# EasyEDA Pro project PCB.eprj, schematic Schematic2_1
Board Name: 电机双驱_终; Create Date: 2024-12-27; Page Name: 逐飞原理图; Project Name: 原创DRV8701E电机双驱; Schematic Name: Schematic2_1; Update Date: 2025-03-12; Company: 嘉立创EDA; Page Size: A4; Version: V1.0
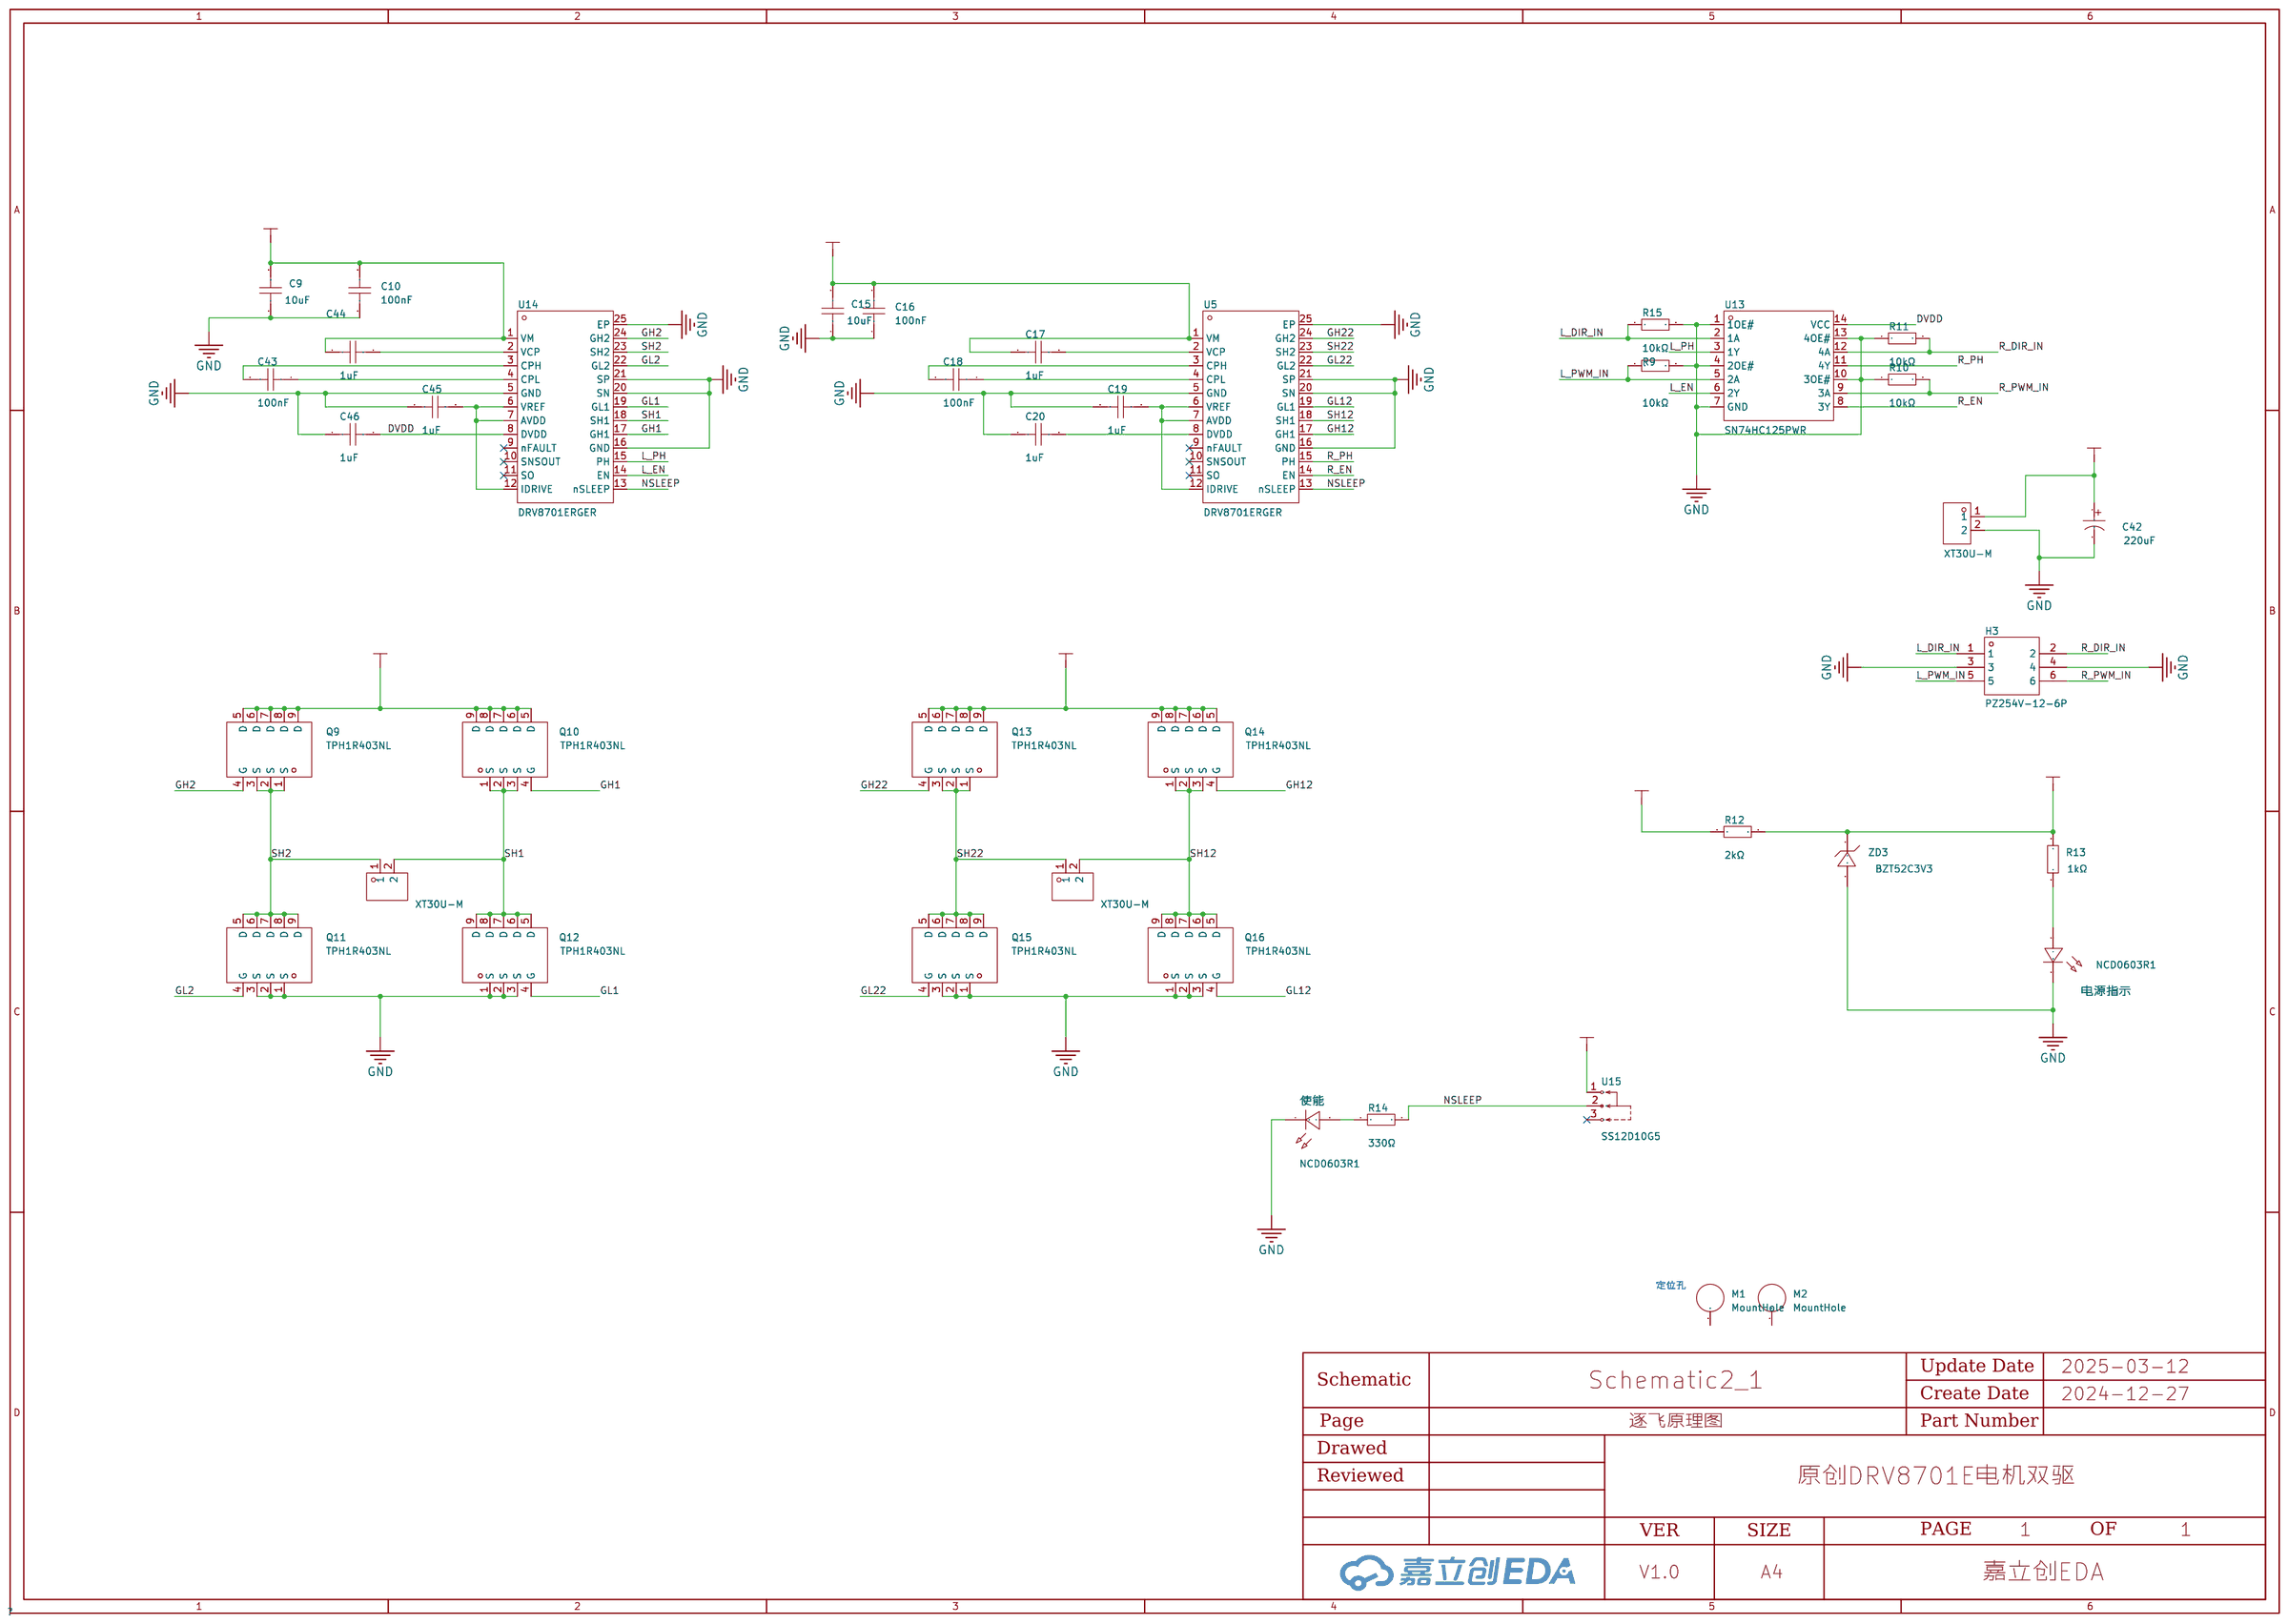
[diagram p2: schematic sheet]

## Parts
C9  10uF  [C0603]
C10  100nF  [C0603]
C15  10uF  [C0603]
C16  100nF  [C0603]
C17  1uF  [C0603]
C18  100nF  [C0603]
C19  1uF  [C0603]
C20  1uF  [C0603]
C42  220uF  [CAP-TH_BD6.3-P2.50-D1.0-FD]
C43  100nF  [C0603]
C44  1uF  [C0603]
C45  1uF  [C0603]
C46  1uF  [C0603]
CN1  XT30U-M  [CONN-TH_XT30U-M]
CN2  XT30U-M  [CONN-TH_XT30U-M]
CN3  XT30U-M  [CONN-TH_XT30U-M]
H3  PZ254V-12-6P  [HDR-TH_6P-P2.54-V-M-R2-C3-S2.54]
M1  MountHole  [M3-MountHole-Plated]
M2  MountHole  [M3-MountHole-Plated]
Q9  TPH1R403NL  [DSOP-8_L5.0-W5.0-P1.27-LS6.0-BL-EP]
Q10  TPH1R403NL  [DSOP-8_L5.0-W5.0-P1.27-LS6.0-BL-EP]
Q11  TPH1R403NL  [DSOP-8_L5.0-W5.0-P1.27-LS6.0-BL-EP]
Q12  TPH1R403NL  [DSOP-8_L5.0-W5.0-P1.27-LS6.0-BL-EP]
Q13  TPH1R403NL  [DSOP-8_L5.0-W5.0-P1.27-LS6.0-BL-EP]
Q14  TPH1R403NL  [DSOP-8_L5.0-W5.0-P1.27-LS6.0-BL-EP]
Q15  TPH1R403NL  [DSOP-8_L5.0-W5.0-P1.27-LS6.0-BL-EP]
Q16  TPH1R403NL  [DSOP-8_L5.0-W5.0-P1.27-LS6.0-BL-EP]
R9  10kΩ  [R0603]
R10  10kΩ  [R0603]
R11  10kΩ  [R0603]
R12  2kΩ  [R0603]
R13  1kΩ  [R0603]
R14  330Ω  [R0603]
R15  10kΩ  [R0603]
U5  DRV8701ERGER  [VQFN-24_L4.0-W4.0-P0.50-BL-EP2.5]
U13  SN74HC125PWR  [TSSOP-14_L5.0-W4.4-P0.65-LS6.5-BL]
U14  DRV8701ERGER  [VQFN-24_L4.0-W4.0-P0.50-BL-EP2.5]
U15  SS12D10G5  [SW-TH_SHOU-HAN_SS12D10G4]
ZD3  BZT52C3V3  [SOD-123_L2.8-W1.8-LS3.7-RD]
使能  NCD0603R1  [LED0603-RD_RED]
电源指示  NCD0603R1  [LED0603-RD_RED]

## Library data of the parts
C9 C15 = CC0603KRX5R6BB106: 容值:10uF;精度:±10%;额定电压:10V;材质(温度系数):X5R;; LCSC Part Name: 10uF ±10% 10V; Supplier Part: C326057; Manufacturer: YAGEO(国巨); Supplier Footprint: 0603; JLCPCB Part Class: Extended Part; Datasheet: https://atta.szlcsc.com/upload/public/pdf/source/20181031/C326057_4190003E428C5A97DF6434D0EAB53BEA.pdf; Supplier: LCSC; Tolerance: ±10%; Voltage Rated: 10V; Temperature Coefficient: X5R
C10 C16 C18 C43 = CC0603KRX7R0BB104: 容值:100nF;精度:±10%;额定电压:100V;材质(温度系数):X7R;; LCSC Part Name: 100nF ±10% 100V; Supplier Part: C113803; Manufacturer: YAGEO(国巨); Supplier Footprint: 0603; JLCPCB Part Class: Extended Part; Datasheet: https://atta.szlcsc.com/upload/public/pdf/source/20181015/C113803_C823A7F2167996AC3CF21DCEABCAAB90.pdf; Supplier: LCSC; Tolerance: ±10%; Voltage Rated: 100V; Temperature Coefficient: X7R
C17 C19 C20 C44-C46 = CC0603KRX5R7BB105: 容值:1uF;精度:±10%;额定电压:16V;材质(温度系数):X5R;; LCSC Part Name: 1uF ±10% 16V; Supplier Part: C106215; Manufacturer: YAGEO(国巨); Supplier Footprint: 0603; JLCPCB Part Class: Extended Part; Datasheet: https://atta.szlcsc.com/upload/public/pdf/source/20180326/C106215_8B940387666B281FC7797B8C1E6DEEC9.pdf; Supplier: LCSC; Tolerance: ±10%; Voltage Rated: 16V; Temperature Coefficient: X5R
C42 = 25YXJ220M6.3X11: 容值:220uF;精度:±20%;额定电压:25V;纹波电流:400mA@100kHz;等效串联电阻:220mΩ@100kHz;; LCSC Part Name: 220uF±20%25V; Supplier Part: C88729; Manufacturer: rubycon(红宝石); Supplier Footprint: 插件,D6.3xL11mm; JLCPCB Part Class: 扩展库; Datasheet: https://atta.szlcsc.com/upload/public/pdf/source/20161125/1480067872683.pdf; Supplier: LCSC; Tolerance: ±20%; Rated Voltage: 25V; φD: 6.3mm; L: 11mm; Lead Spacing: 2.5mm; Ripple Current: 400mA@100kHz; Equivalent Series Resistance(ESR): 220mΩ@100kHz; Lifetime @ Temp: 7000hrs@105℃
CN1-CN3 = XT30U-M: 类别:-;类型1:-;; LCSC Part Name: AMASS(艾迈斯)轻量版锂电池插头公头 XT30U-M; Supplier Part: C99101; Manufacturer: AMASS(艾迈斯); JLCPCB Part Class: 扩展库; Datasheet: https://atta.szlcsc.com/upload/public/pdf/source/20170606/1496716542582.pdf; Supplier: LCSC; Type: 插头; Colour: 黄色; InterfaceType: 公头
H3 = PZ254V-12-6P: 插针结构:2x3P;间距:2.54mm;行距:2.54mm;圆针/方针:方针;安装类型:直插;排数:双排;总PIN位数:6P;额定电流:-;额定电压:-;配合针长度:6mm;塑高:2.5mm;端接针长度:3mm;触头材质:黄铜;触头镀层:-;工作温度范围:-40℃~+105℃;颜色:黑色;; LCSC Part Name: 间距:2.54mm 2x3P 直插 方针; Supplier Part: C492420; Manufacturer: XFCN(兴飞); Supplier Footprint: 插件,P=2.54mm; JLCPCB Part Class: 扩展库; Datasheet: https://atta.szlcsc.com/upload/public/pdf/source/20200309/C492420_BAECB307B001054C09D200388220EAE6.pdf; Supplier: LCSC; Pin Structure: 2x3P; Pitch: 2.54mm; Row Spacing: 2.54mm; Circluar Pins/Square Pins: 方针; Mounting Type: 直插; Number of Rows: 双排; Number of Pins: 6P; Length of Mating Pin: 6mm; Insulation Height: 2.5mm; Length of End Connection Pin: 3mm; Contact Material: 黄铜; Operating Temperature Range: -40℃~+105℃; Color: 黑色
M1 M2 = MountHole: Origin Footprint 2: M3-MountHole; Origin Footprint 3: M3-MountSlot; Origin Footprint 4: M3-MountSlot-Plated; Origin Footprint 5: M3-MountHole-4mm; Origin Footprint 6: M3-MountHole-5mm; Origin Footprint 7: M3-MountHole-6mm; Origin Footprint 8: M3-MountHole-7mm; Origin Footprint 9: M3-MountHole-8mm; Origin Footprint 10: M3-MountHole-9mm; Origin Footprint 11: M3-MountHole-10mm; Origin Footprint 12: M3-MountHole-11mm; Origin Footprint 13: M3-MountHole-12mm; Origin Footprint 14: M3-MountHole-13mm; Origin Footprint 15: M3-MountHole-14mm; Origin Footprint 16: M3-MountHole-15mm; Origin Footprint 17: M3-MountHole-16mm; Origin Footprint 18: M3-MountHole-17mm; Origin Footprint 19: M3-MountHole-18mm; Origin Footprint 20: M3-MountHole-19mm; Origin Footprint 21: M3-MountHole-20mm; Origin Footprint 22: M3-MountHole-Plated-4MM; Origin Footprint 23: M3-MountHole-Plated-5MM; Origin Footprint 24: M3-MountHole-Plated-6MM; Origin Footprint 25: M3-MountHole-Plated-7MM; Origin Footprint 26: M3-MountHole-Plated-8MM; Origin Footprint 27: M3-MountHole-Plated-9MM; Origin Footprint 28: M3-MountHole-Plated-10MM; Origin Footprint 29: M3-MountHole-Plated-11MM; Origin Footprint 30: M3-MountHole-Plated-12MM; Origin Footprint 31: M3-MountHole-Plated-13MM; Origin Footprint 32: M3-MountHole-Plated-14MM; Origin Footprint 33: M3-MountHole-Plated-15MM; Origin Footprint 34: M3-MountHole-Plated-16MM; Origin Footprint 35: M3-MountHole-Plated-17MM; Origin Footprint 36: M3-MountHole-Plated-18MM; Origin Footprint 37: M3-MountHole-Plated-19MM; Origin Footprint 38: M3-MountHole-Plated-20MM
Q9-Q16 = TPH1R403NL_C83440: 类型:1个N沟道;漏源电压(Vdss):30V;连续漏极电流(Id):150A;导通电阻(RDS(on)@Vgs,Id):1.7mΩ@4.5V,30A;功率(Pd):64W;阈值电压(Vgs(th)@Id):1.3V@0.5mA;; LCSC Part Name: 1个N沟道 耐压:30V 电流:150A; Supplier Part: C83440; Manufacturer: TOSHIBA(东芝); Supplier Footprint: DFN-8(5x6); JLCPCB Part Class: Extended Part; Datasheet: https://atta.szlcsc.com/upload/public/pdf/source/20170908/C83440_1504870121708958077.pdf; Supplier: LCSC; Type: 1个N沟道; Drain Source Voltage (Vdss): 30V; Continuous Drain Current (Id): 150A; Drain Source On Resistance (RDS(on)@Vgs,Id): 1.7mΩ@4.5V,30A; Power Dissipation (Pd): 64W; Gate Threshold Voltage (Vgs(th)@Id): 1.3V@0.5mA; Total Gate Charge (Qg@Vgs): 46nC@15V; Input Capacitance (Ciss@Vds): 3.4nF@15V; Reverse Transfer Capacitance (Crss@Vds): 200pF@15V; Operating Temperature: -55℃~+150℃
R9-R11 R15 = 0603WAF1002T5E: 电阻类型:厚膜电阻;阻值:10kΩ;精度:±1%;功率:100mW;温度系数:±100ppm/℃;最大工作电压:75V;工作温度范围:-55℃~+155℃;; LCSC Part Name: 10kΩ ±1% 100mW; Supplier Part: C25804; Manufacturer: UNI-ROYAL(厚声); Supplier Footprint: 0603; JLCPCB Part Class: Basic Part; Datasheet: https://atta.szlcsc.com/upload/public/pdf/source/20200306/C422600_1E6D84923E4A46A82E41ADD87F860B5C.pdf; Supplier: LCSC; Type: 厚膜电阻; Tolerance: ±1%; Power(Watts): 100mW; Temperature Coefficient: ±100ppm/℃; Overload Voltage (Max): 75V; Operating Temperature Range: -55℃~+155℃
R12 = 0603WAF2001T5E: 电阻类型:厚膜电阻;阻值:2kΩ;精度:±1%;功率:100mW;温度系数:±100ppm/℃;最大工作电压:75V;工作温度范围:-55℃~+155℃;; LCSC Part Name: 2kΩ ±1% 100mW; Supplier Part: C22975; Manufacturer: UNI-ROYAL(厚声); Supplier Footprint: 0603; JLCPCB Part Class: Basic Part; Datasheet: https://atta.szlcsc.com/upload/public/pdf/source/20200306/C422600_1E6D84923E4A46A82E41ADD87F860B5C.pdf; Supplier: LCSC; Type: 厚膜电阻; Tolerance: ±1%; Power(Watts): 100mW; Temperature Coefficient: ±100ppm/℃; Overload Voltage (Max): 75V; Operating Temperature Range: -55℃~+155℃
R13 = 0603WAF1001T5E: 电阻类型:厚膜电阻;阻值:1kΩ;精度:±1%;功率:100mW;最大工作电压:75V;温度系数:±100ppm/℃;; LCSC Part Name: 1kΩ ±1% 100mW 厚膜电阻; Supplier Part: C21190; Manufacturer: UNI-ROYAL(厚声); Supplier Footprint: 0603; JLCPCB Part Class: Basic Part; Datasheet: https://atta.szlcsc.com/upload/public/pdf/source/20200306/C422600_1E6D84923E4A46A82E41ADD87F860B5C.pdf; Supplier: LCSC; Type: 厚膜电阻; Tolerance: ±1%; Power(Watts): 100mW; Overload Voltage (Max): 75V; Temperature Coefficient: ±100ppm/℃; Operating Temperature Range: -55℃~+155℃
R14 = AC0603FR-07330RL: 电阻类型:厚膜电阻;阻值:330Ω;精度:±1%;功率:100mW;温度系数:±100ppm/℃;最大工作电压:75V;工作温度范围:-55℃~+155℃;; LCSC Part Name: 330Ω ±1%; Supplier Part: C144668; Manufacturer: YAGEO(国巨); Supplier Footprint: 0603; JLCPCB Part Class: Extended Part; Datasheet: https://atta.szlcsc.com/upload/public/pdf/source/20171225/C144668_15141880408521202956.pdf; Supplier: LCSC; Type: 厚膜电阻; Tolerance: ±1%; Power(Watts): 100mW; Temperature Coefficient: ±100ppm/℃; Overload Voltage (Max): 75V; Operating Temperature Range: -55℃~+155℃
U5 U14 = DRV8701ERGER: DRV8701 47V H 桥智能栅极驱动器; LCSC Part Name: 有刷直流电机驱动芯片 45V; Supplier Part: C90964; Manufacturer: TI(德州仪器); Supplier Footprint: VQFN-24-EP(4x4); JLCPCB Part Class: Extended Part; Datasheet: https://www.ti.com/cn/lit/gpn/drv8701; Supplier: LCSC
U13 = SN74HC125PWR: 输入类型:-;电源电压:2V~6V;元件数:4;每个元件位数:1;灌电流(IOL):7.8mA;拉电流(IOH):7.8mA;; Supplier Part: C132994; Manufacturer: TI(德州仪器); Supplier Footprint: TSSOP-14; JLCPCB Part Class: Extended Part; Datasheet: https://www.ti.com/cn/lit/gpn/sn74hc125; Supplier: LCSC; Type: 缓冲器，非反相; Supply Voltage: 2V~6V; output type: 三态; Current-OutputLow: 7.8mA; Current-OutputHigh: 7.8mA; Operating temperature: -40℃~+85℃; Number of Elements: 4; Number of Bits per Element: 1; Sink Current: 7.8mA; Source Current: 7.8mA; Logic Family: 74HC; Operating Temperature: -40℃~+85℃
U15 = SS12D10G5: 电路结构:单刀双掷;安装方式:直插;额定电流(DC):2A;额定电压(DC):125V;机械寿命:3千次;; LCSC Part Name: 两档立式插件 3脚拨动开关 柄长5.0mm; Supplier Part: C7431054; Manufacturer: SHOU HAN(首韩); Supplier Footprint: 插件; JLCPCB Part Class: Extended Part; Datasheet: https://atta.szlcsc.com/upload/public/pdf/source/20231130/7A3DB6A149BF0A1DCFFE64FFC07FE434.pdf; Supplier: LCSC; Circuit: 单刀双掷; Switch Length: 12.7mm; Switch Width: 6.7mm; Mounting Style: 直插; Current Rating (DC): 2A; Voltage Rating (DC): 125V; Mechanical Life: 3千次; Operating Temperature: -25℃~+70℃
ZD3 = BZT52C3V3_C2112: 二极管配置:独立式;稳压值(标称值):3.3V;稳压值(范围):3.1V~3.5V;功率:350mW;精度:-;; Supplier Part: C2112; Manufacturer: CJ(江苏长电/长晶); Supplier Footprint: SOD-123; JLCPCB Part Class: Extended Part; Datasheet: https://atta.szlcsc.com/upload/public/pdf/source/20170413/1492062904174.pdf; Supplier: LCSC; Diode Configuration: 独立式; Zener Voltage (Nom): 3.3V; Zener Voltage (Range): 3.1V~3.5V; Power Dissipation: 350mW; Reverse Leakage Current (Ir): 5uA@1V; Zener Impedance (Zzt): 95Ω
使能 电源指示 = NCD0603R1_C84263: 灯头类型:-;发光颜色:红色;正向电压(VF):1.6V~2.6V;功率:65mW;正向电流:20mA;主波长:615nm~630nm;二极管配置:独立二极管;透镜颜色:无色透明透镜;色温:-;发光强度:80mcd~220mcd;发光角度:130°;载带方式:-;工作温度:-30℃~+85℃;; Supplier Part: C84263; Manufacturer: 国星光电; Supplier Footprint: 0603; JLCPCB Part Class: Extended Part; Datasheet: https://atta.szlcsc.com/upload/public/pdf/source/20200820/C84263_DABC6A75E58F576973B407FDBA283D60.pdf; Supplier: LCSC; Emitted Color: 红色; Forward Voltage (VF): 1.6V~2.6V; Power Dissipation: 65mW; Forward Current: 20mA; Dominant Wavelength: 615nm~630nm; Diode Configuration: 独立二极管; Lens Color: 无色透明透镜; Luminous Intensity: 80mcd~220mcd; Viewing Angle: 130°; Operating Temperature: -30℃~+85℃

## Nets
3.3V: R12.2 R13.2 U15.1 ZD3.1(K)
DVDD: C46.2 U13.14(VCC) U14.8(DVDD)
GND: C9.1 C10.1 C15.1 C16.1 C19.1 C20.1 C42.2 C45.1 C46.1 CN1.2 H3.3 H3.4 Q11.1(S) Q11.2(S) Q11.3(S) Q12.1(S) Q12.2(S) Q12.3(S) Q15.1(S) Q15.2(S) Q15.3(S) Q16.1(S) Q16.2(S) Q16.3(S) R9.2 R10.1 R11.1 R15.2 U5.5(GND) U5.16(GND) U5.20(SN) U5.21(SP) U5.25(EP) U13.1(1OE#) U13.4(2OE#) U13.7(GND) U13.10(3OE#) U13.13(4OE#) U14.5(GND) U14.16(GND) U14.20(SN) U14.21(SP) U14.25(EP) ZD3.2(A) 使能.1(C) 电源指示.1(C)
GH1: Q10.4(G) U14.17(GH1)
GH2: Q9.4(G) U14.24(GH2)
GH12: Q14.4(G) U5.17(GH1)
GH22: Q13.4(G) U5.24(GH2)
GL1: Q12.4(G) U14.19(GL1)
GL2: Q11.4(G) U14.22(GL2)
GL12: Q16.4(G) U5.19(GL1)
GL22: Q15.4(G) U5.22(GL2)
L_DIR_IN: H3.1 R15.1 U13.2(1A)
L_EN: U13.6(2Y) U14.14(EN)
L_PH: U13.3(1Y) U14.15(PH)
L_PWM_IN: H3.5 R9.1 U13.5(2A)
NSLEEP: R14.2 U5.13(nSLEEP) U14.13(nSLEEP) U15.2
R_DIR_IN: H3.2 R11.2 U13.12(4A)
R_EN: U5.14(EN) U13.8(3Y)
R_PH: U5.15(PH) U13.11(4Y)
R_PWM_IN: H3.6 R10.2 U13.9(3A)
SH1: CN2.2 Q10.1(S) Q10.2(S) Q10.3(S) Q12.5(D) Q12.6(D) Q12.7(D) Q12.8(D) Q12.9(D) U14.18(SH1)
SH2: CN2.1 Q9.1(S) Q9.2(S) Q9.3(S) Q11.5(D) Q11.6(D) Q11.7(D) Q11.8(D) Q11.9(D) U14.23(SH2)
SH12: CN3.2 Q14.1(S) Q14.2(S) Q14.3(S) Q16.5(D) Q16.6(D) Q16.7(D) Q16.8(D) Q16.9(D) U5.18(SH1)
SH22: CN3.1 Q13.1(S) Q13.2(S) Q13.3(S) Q15.5(D) Q15.6(D) Q15.7(D) Q15.8(D) Q15.9(D) U5.23(SH2)
VM: C9.2 C10.2 C15.2 C16.2 C17.1 C42.1 C44.1 CN1.1 Q9.5(D) Q9.6(D) Q9.7(D) Q9.8(D) Q9.9(D) Q10.5(D) Q10.6(D) Q10.7(D) Q10.8(D) Q10.9(D) Q13.5(D) Q13.6(D) Q13.7(D) Q13.8(D) Q13.9(D) Q14.5(D) Q14.6(D) Q14.7(D) Q14.8(D) Q14.9(D) R12.1 U5.1(VM) U14.1(VM)
$3N18428: R13.1 电源指示.2(A)
$3N18460: R14.1 使能.2(A)
$3N18468: C20.2 U5.8(DVDD)
$3N18476: C19.2 U5.6(VREF) U5.7(AVDD) U5.12(IDRIVE)
$3N18483: C17.2 U5.2(VCP)
$3N18484: C18.2 U5.3(CPH)
$3N18485: C18.1 U5.4(CPL)
$3N18498: C45.2 U14.6(VREF) U14.7(AVDD) U14.12(IDRIVE)
$3N18502: C44.2 U14.2(VCP)
$3N18503: C43.1 U14.4(CPL)
$3N18505: C43.2 U14.3(CPH)

Not connected (* = marked no-connect by the designer): M1 1; M2 1; U5 9(nFAULT)* 10(SNSOUT)* 11(SO)*; U14 9(nFAULT)* 10(SNSOUT)* 11(SO)*; U15 3*

## Notes on the sheet
- 定位孔
